# EAGLE design SnapBIT-DUO (EAGLE 7.3.0)
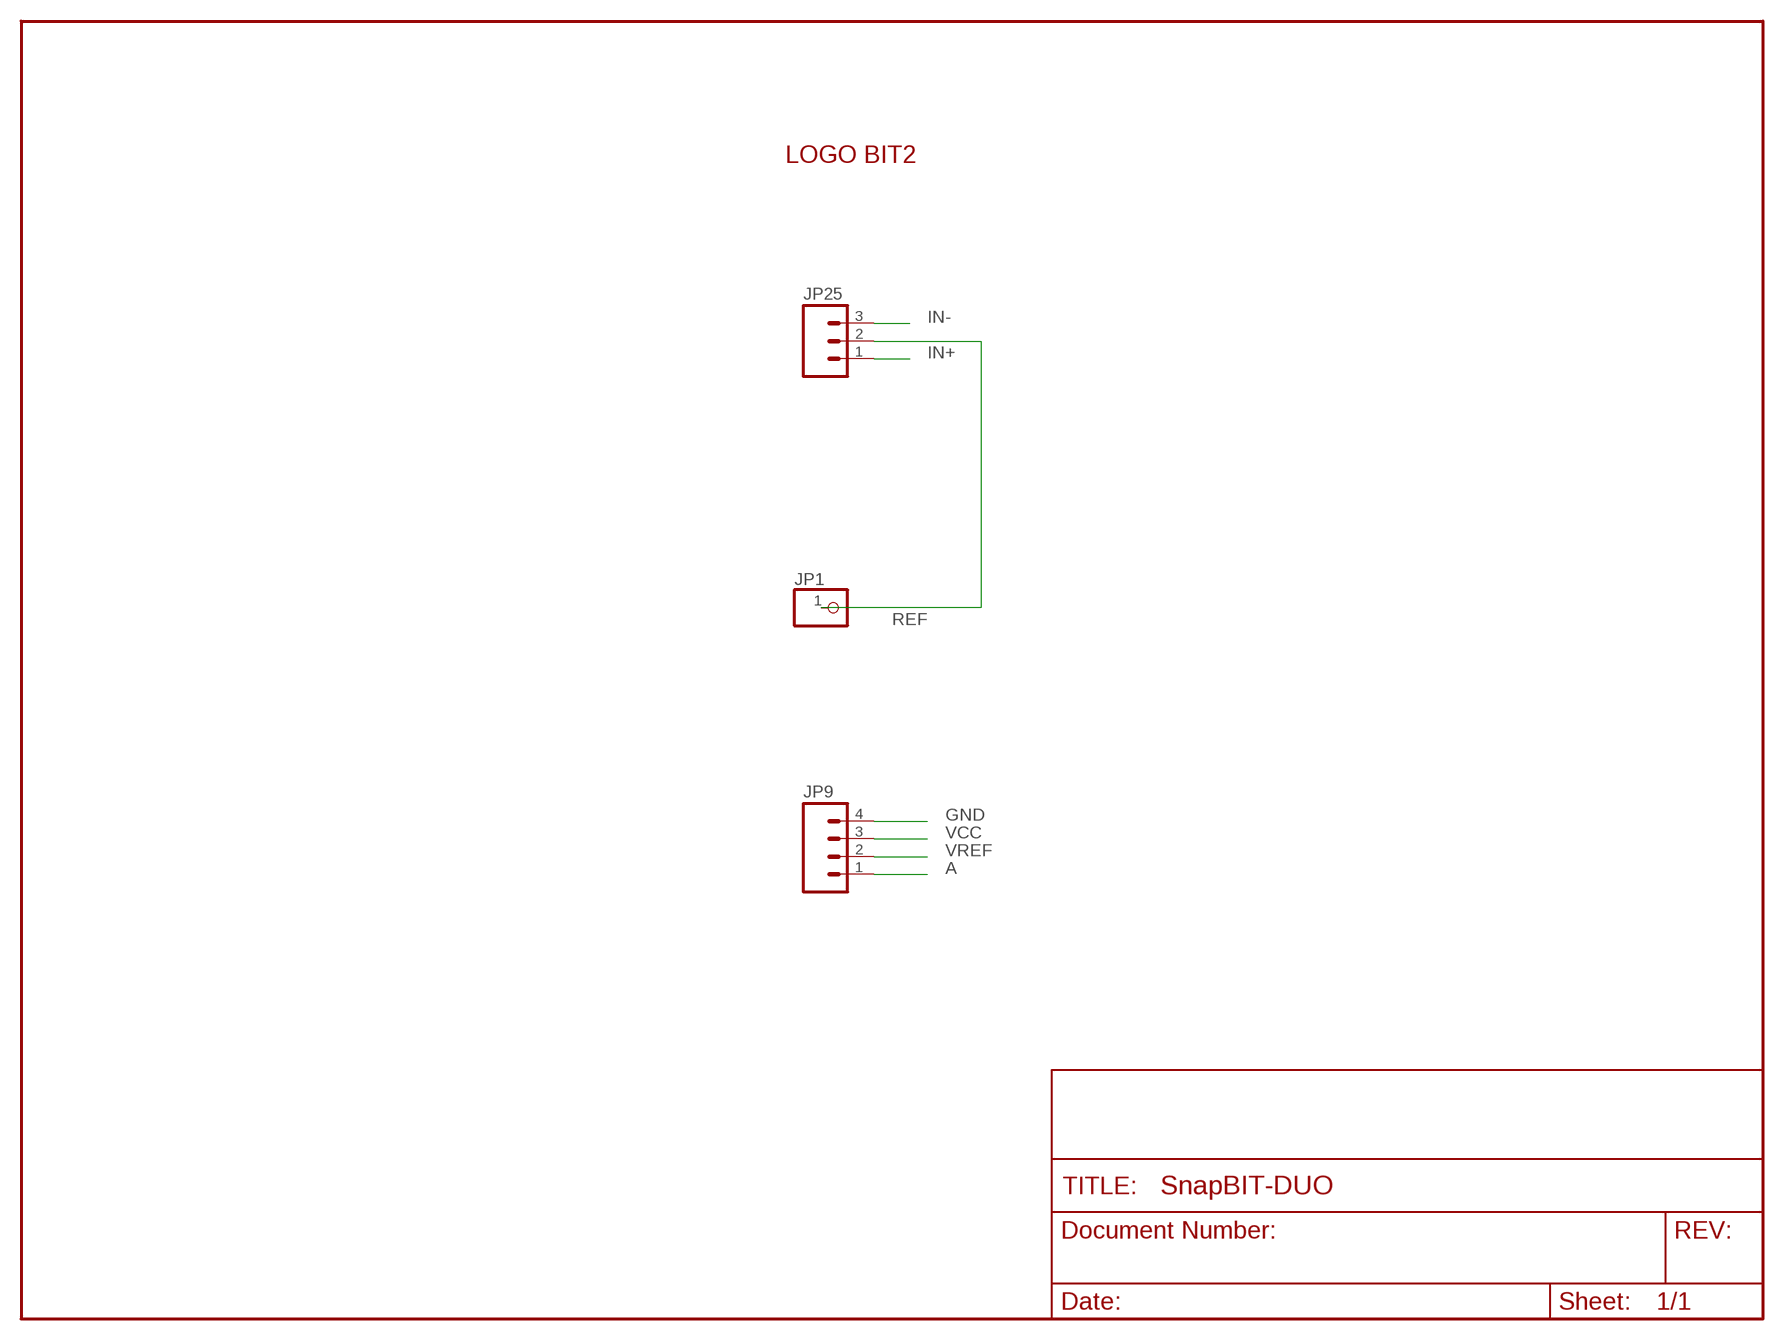
[diagram p0: schematic, sheet 1]

## Parts
JP1  PINHD-1X1  [1X01]
JP9  M04JST-PTH  [JST-4-PTH]
JP25  M03JST-PTH  [JST-3-PTH]
U$1  LOGO_BIT2(4.72X3.78)  [LOGO_BIT2]

## Nets
A: JP9.1
GND: JP9.4
IN+: JP25.1
IN-: JP25.3
REF: JP1.1 JP25.2
VCC: JP9.3
VREF: JP9.2

## Library data of the parts
JP1 = pinhead:PINHD-1X1: PIN HEADER
JP9 = SparkFun:M04: Header 4 Standard 4-pin 0.1" header. Use with straight break away headers (SKU : PRT-00116), right angle break away headers (PRT-00553), swiss pins (PRT-00743), machine pins (PRT-00117), and female headers (PRT-00115). Molex polarized connector foot print use with SKU : PRT-08231 with associated crimp pins and housings. 1MM SMD Version SKU: PRT-10208
JP25 = SparkFun:M03: Header 3 Standard 3-pin 0.1" header. Use with straight break away headers (SKU : PRT-00116), right angle break away headers (PRT-00553), swiss pins (PRT-00743), machine pins (PRT-00117), and female headers (PRT-00115). Molex polarized connector foot print use with SKU : PRT-08232 with associated crimp pins and housings.
U$1 = bit2_logo_27x8:LOGO_BIT2(4.72X3.78)

## Board
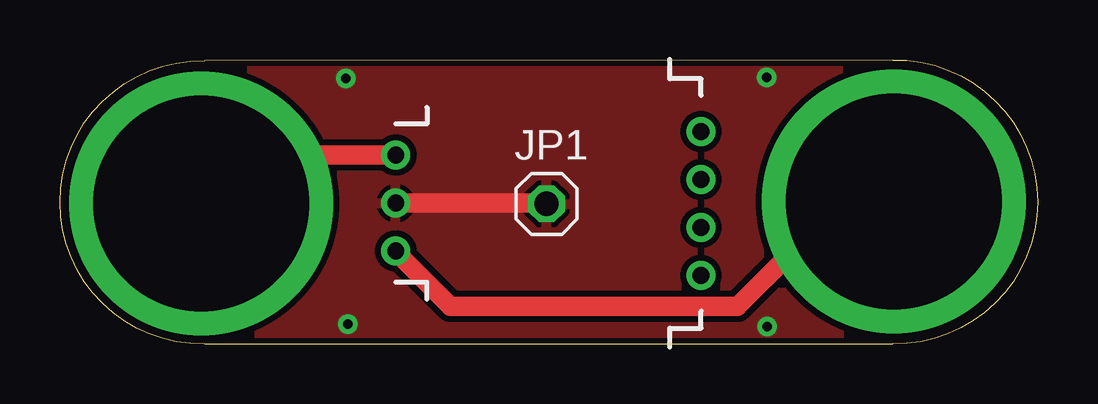
[diagram p1: board, top side]
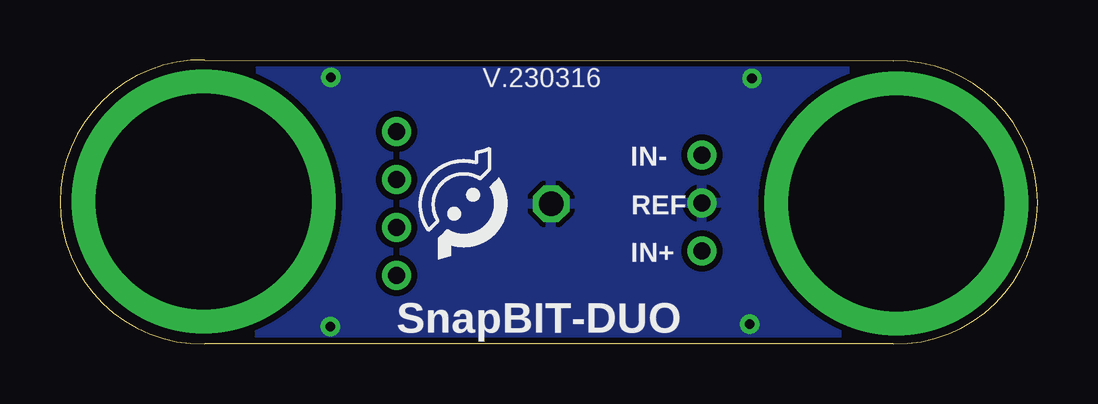
[diagram p2: board, bottom side, seen from below]

Size 40.75 x 11.85 mm. Coordinates in mm from the lower left corner, seen from the top.
Outline: 34.71,11.85 6.02,11.81 arc182 6.02,0 34.71,0 arc182 34.71,11.85
Copper layers (1*16): Top 0.035mm / dielectric 1mm / Bottom 0.035mm
Design rules "bitalino *": minimum track width 6mil, minimum drill 8mil, track to track 8mil, track to pad 8mil, pad to pad 8mil, via to via 8mil, smd to smd 8mil, copper to edge 2mil, drill to drill 8mil, minimum pad ring 10mil, minimum via ring 8mil, stop-mask expansion 6mil, vias tented up to drill 15mil, thermal gap 8mil

### Footprints (pad centres in the part's own frame; a part is rotated, then mirrored left to right if it is on the bottom)
1X01 = drill 1.016 octagon: 1 0,0
JST-4-PTH = drill 0.7: 1 -3,-5; 2 -1,-5; 3 1,-5; 4 3,-5
JST-3-PTH = drill 0.7: 1 -2,-5; 2 0,-5; 3 2,-5

### Placement (x,y rotation side)
JP1  20.28,5.85 0 top
JP9  31.72,5.86 270 top
JP25  9,5.87 90 top
U$1  25.85,8.2 270 bottom

### Tracks (layer width: path | path; a pad name or v marks a point on that pad's centre or on a via)
IN+  (via drill 9 pad 11)
  Top 0.813: JP25.1 14,3.85 16.27,1.58 28.24,1.58 32.6,5.93 v34.76,5.93
IN-  (via drill 9 pad 11)
  Top 0.813: JP25.3 8.9,7.87 v5.89,5.86
REF  (via drill 0.4)
  Top 0.305: 20.25,5.87 JP1.1
  Top 0.406: 20.28,5.87 JP1.1
  Top 0.813: JP25.2 20.25,5.87
  Bottom 0.406: 20.28,5.87 JP1.1
  other vias: 11.91,11.07 12,0.83 29.46,11.12 29.48,0.73
  pour Top (isolate 0.254): 40.16,12.1 40.23,-0.46 0.7,-0.16 0.69,12.28
  pour Bottom (isolate 0.254): 40.18,12.02 40.21,-0.07 0.61,-0.26 0.84,12.03

### Text on the board
_bsilk: V.230316 | IN- | REF | IN+ | SnapBIT-DUO
Notes: (40,72X11,86)